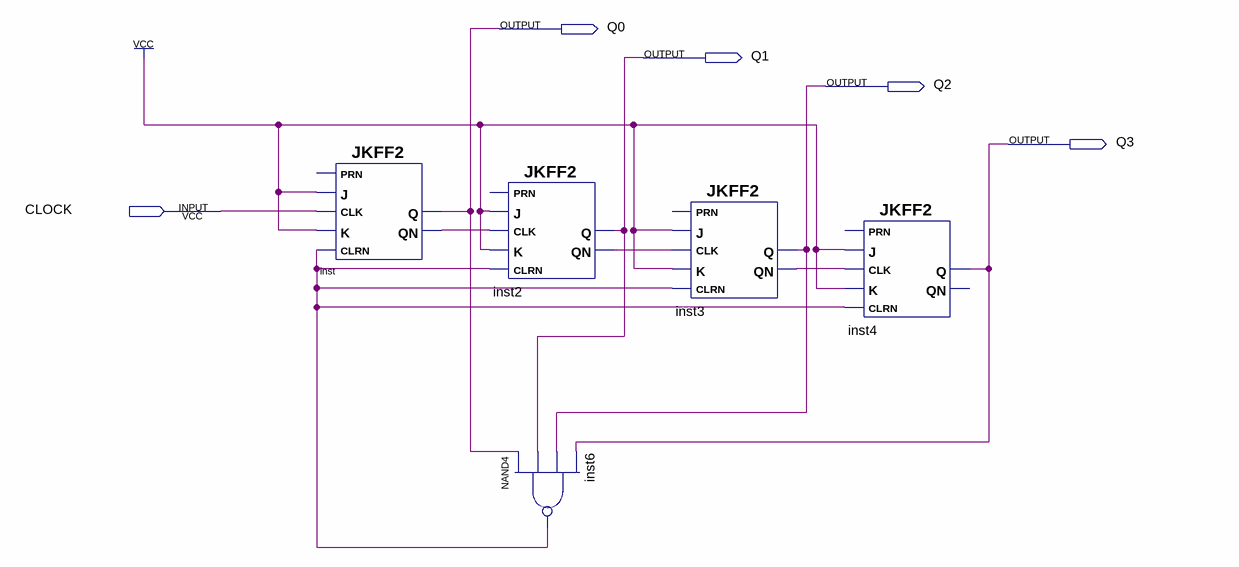
[diagram p0: schematic sheet]
// Quartus schematic ex3.bdf as structural Verilog: 5 symbols, 5 pins
module ex3 (
  input  CLOCK,
  output Q0,
  output Q1,
  output Q2,
  output Q3
);

  wire inst2_qn, inst3_qn, inst6_out, inst_qn;

  JKFF2 inst (.K(1'b1), .CLRN(inst6_out), .CLK(CLOCK), .J(1'b1), .QN(inst_qn), .Q(Q0));  // open: PRN
  JKFF2 inst2 (.K(1'b1), .CLRN(inst6_out), .CLK(inst_qn), .J(1'b1), .QN(inst2_qn), .Q(Q1));  // open: PRN
  nand inst6 (inst6_out, Q0, Q1, Q2, Q3);
  JKFF2 inst3 (.K(1'b1), .CLRN(inst6_out), .CLK(inst2_qn), .J(1'b1), .QN(inst3_qn), .Q(Q2));  // open: PRN
  JKFF2 inst4 (.K(1'b1), .CLRN(inst6_out), .CLK(inst3_qn), .J(1'b1), .Q(Q3));  // open: PRN, QN
endmodule
